# EAGLE design sensorluz_01 (EAGLE 6.1)
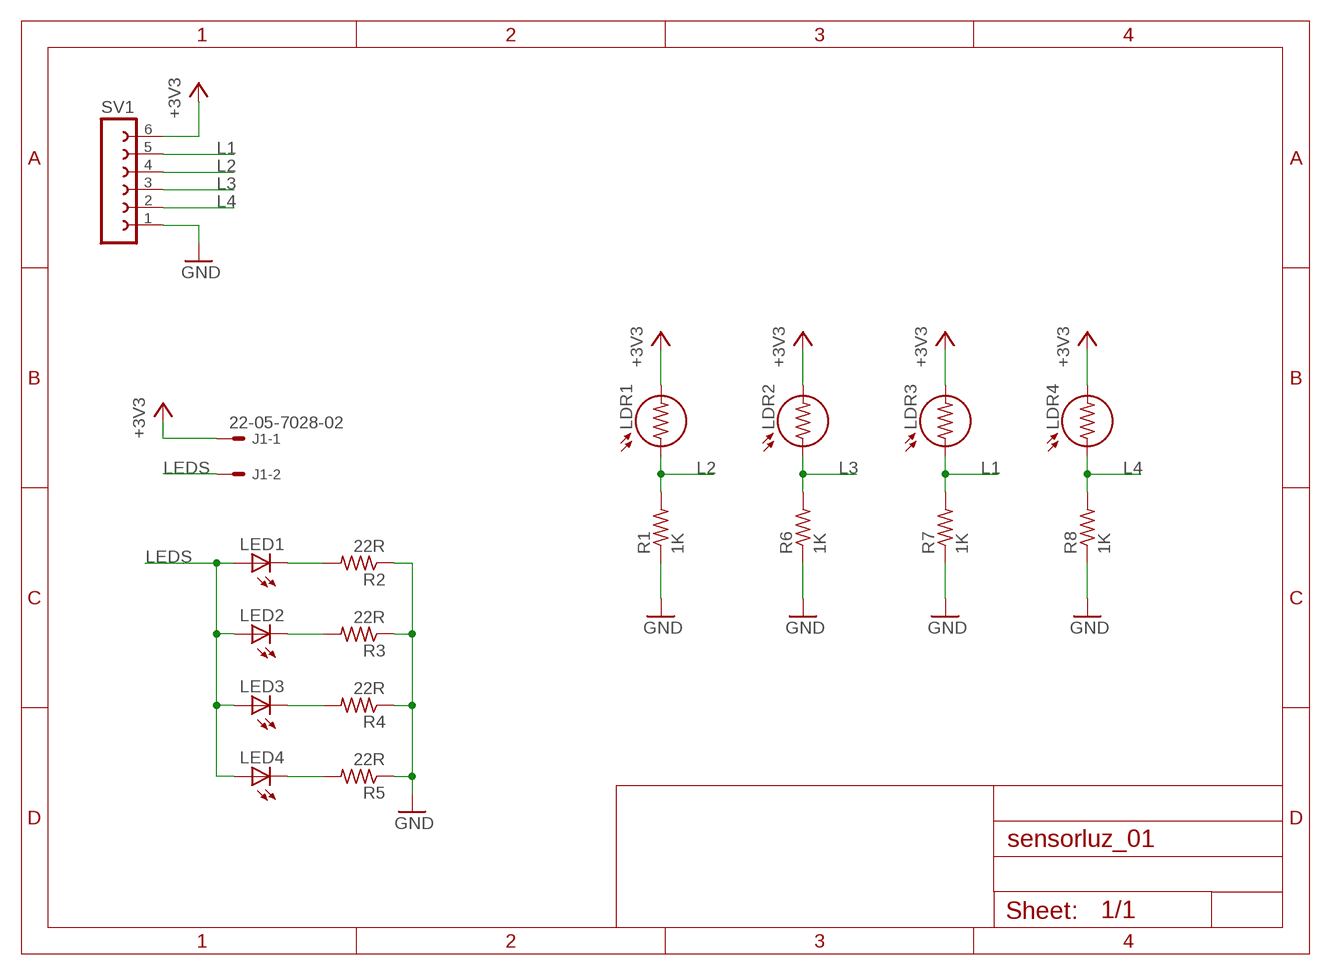
[diagram p0: schematic, sheet 1]

## Parts
J1  22-05-7028-02  [7395-02]
LDR1  LDR5MM  [LDR338-54C]
LDR2  LDR5MM  [LDR338-54C]
LDR3  LDR5MM  [LDR338-54C]
LDR4  LDR5MM  [LDR338-54C]
LED1  LED5MM  [LED5MM]
LED2  LED5MM  [LED5MM]
LED3  LED5MM  [LED5MM]
LED4  LED5MM  [LED5MM]
R1  1K  R-US_0204/5  [0204/5]
R2  22R  R-US_0204/5  [0204/5]
R3  22R  R-US_0204/5  [0204/5]
R4  22R  R-US_0204/5  [0204/5]
R5  22R  R-US_0204/5  [0204/5]
R6  1K  R-US_0204/5  [0204/5]
R7  1K  R-US_0204/5  [0204/5]
R8  1K  R-US_0204/5  [0204/5]
SV1  FE06W  [FE06W]

## Nets
+3V3: J1.1 LDR1.2 LDR2.2 LDR3.2 LDR4.2 SV1.6
GND: R1.1 R2.1 R3.1 R4.1 R5.1 R6.1 R7.1 R8.1 SV1.1
L1: LDR3.1 R7.2 SV1.5
L2: LDR1.1 R1.2 SV1.4
L3: LDR2.1 R6.2 SV1.3
L4: LDR4.1 R8.2 SV1.2
LEDS: J1.2 LED1.A LED2.A LED3.A LED4.A
N$1: LED1.K(C) R2.2
N$2: LED2.K(C) R3.2
N$3: LED3.K(C) R4.2
N$4: LED4.K(C) R5.2

## Library data of the parts
J1 = con-molex:22-?-02: CONNECTOR wire to board 2.54 mm (.1 inch) pitch header
LDR1-LDR4 = gm-resistors:LDR
LED1-LED4 = led:LED: LED OSRAM: - CHIPLED LG R971, LG N971, LY N971, LG Q971, LY Q971, LO R971, LY R971 LH N974, LH R974 LS Q976, LO Q976, LY Q976 LO Q996 - Hyper CHIPLED LW Q18S LB Q993, LB Q99A, LB R99A - SideLED LS A670, LO A670, LY A670, LG A670, LP A670 LB A673, LV A673, LT A673, LW A673 LH A674 LY A675 LS A676, LA A676, LO A676, LY A676, LW A676 LS A679, LY A679, LG A679 - Hyper Micro SIDELED® LS Y876, LA Y876, LO Y876, LY Y876 LT Y87S - SmartLED LW L88C, LW L88S LB L89C, LB L89S, LG L890 LS L89K, LO L89K, LY L89K LS L896, LA L896, LO L896, LY L896 - TOPLED LS T670, LO T670, LY T670, LG T670, LP T670 LSG T670, LSP T670, LSY T670, LOP T670, LYG T670 LG T671, LOG T671, LSG T671 LB T673, LV T673, LT T673, LW T673 LH T674 LS T676, LA T676, LO T676, LY T676, LB T676, LH T676, LSB T676, LW T676 LB T67C, LV T67C, LT T67C, LS T67K, LO T67K, LY T67K, LW E67C LS E67B, LA E67B, LO E67B, LY E67B, LB E67C, LV E67C, LT E67C LW T67C LS T679, LY T679, LG T679 LS T770, LO T770, LY T770, LG T770, LP T770 LB T773, LV T773, LT T773, LW T773 LH T774 LS E675, LA E675, LY E675, LS T675 LS T776, LA T776, LO T776, LY T776, LB T776 LHGB T686 LT T68C, LB T68C - Hyper Mini TOPLED® LB M676 - Mini TOPLED Santana® LG M470 LS M47K, LO M47K, LY M47K Source: http://www.osram.convergy.de LUXEON: - LUMILED® LXK2-PW12-R00, LXK2-PW12-S00, LXK2-PW14-U00, LXK2-PW14-V00 LXK2-PM12-R00, LXK2-PM12-S00, LXK2-PM14-U00 LXK2-PE12-Q00, LXK2-PE12-R00, LXK2-PE12-S00, LXK2-PE14-T00, LXK2-PE14-U00 LXK2-PB12-K00, LXK2-PB12-L00, LXK2-PB12-M00, LXK2-PB14-N00, LXK2-PB14-P00, LXK2-PB14-Q00 LXK2-PR12-L00, LXK2-PR12-M00, LXK2-PR14-Q00, LXK2-PR14-R00 LXK2-PD12-Q00, LXK2-PD12-R00, LXK2-PD12-S00 LXK2-PH12-R00, LXK2-PH12-S00 LXK2-PL12-P00, LXK2-PL12-Q00, LXK2-PL12-R00 Source: www.luxeon.com KINGBRIGHT: KA-3528ASYC Source: www.kingbright.com
R1-R8 = rcl:R-US_: RESISTOR, American symbol
SV1 = con-lsta:FE06W: FEMALE HEADER

## Board
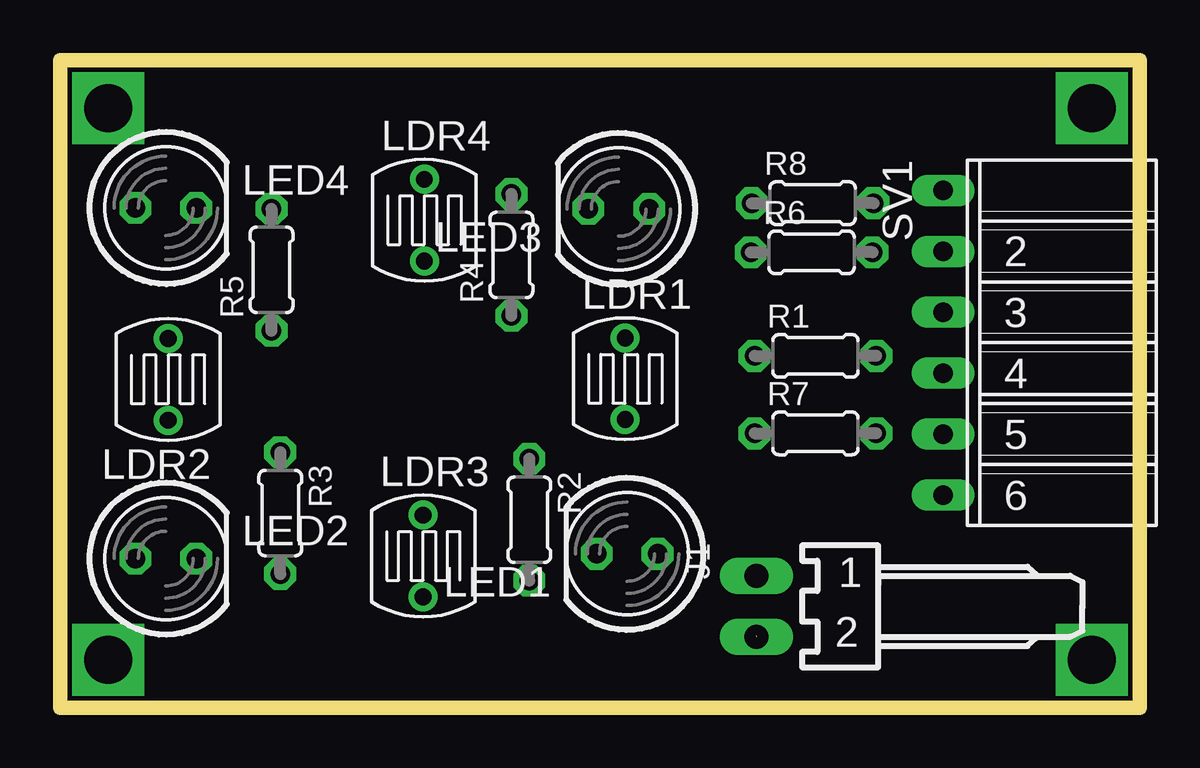
[diagram p1: board, top side]
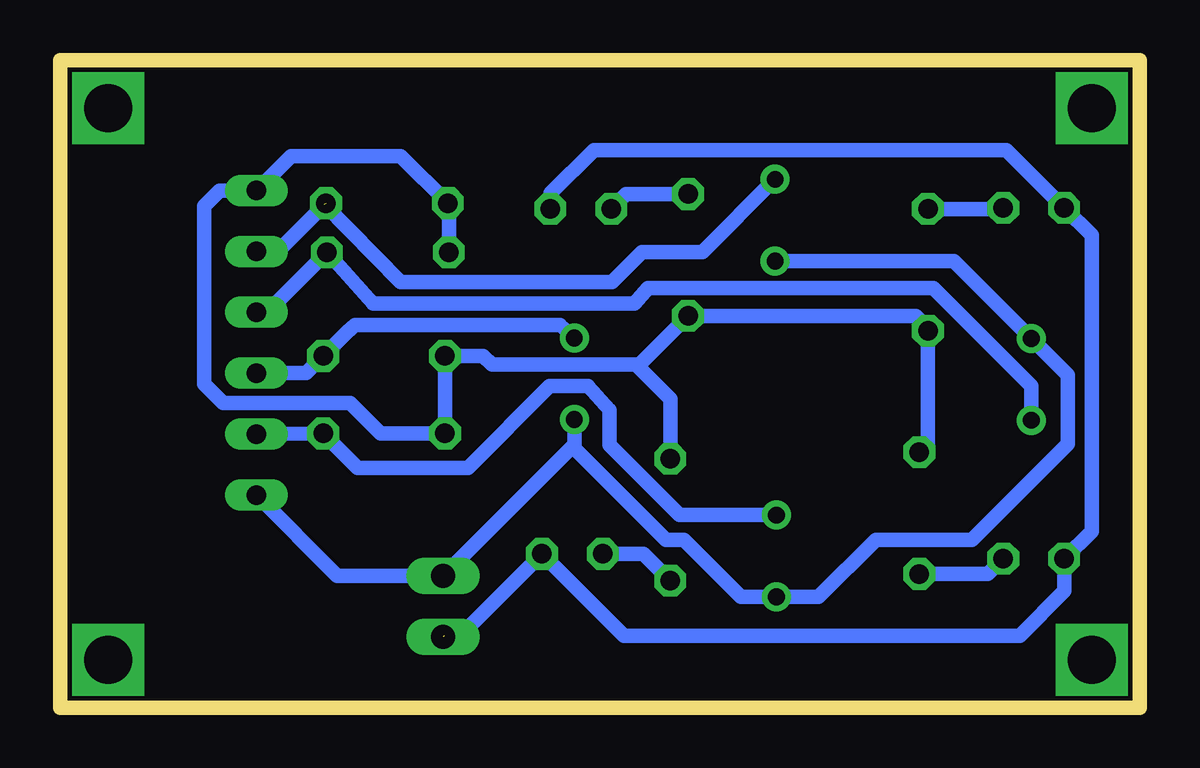
[diagram p2: board, bottom side, seen from below]

Size 45 x 27 mm. Coordinates in mm from the lower left corner, seen from the top.
Outline: 0,0 45,0 45,27 0,27 0,0
Copper layers (1*16): Top 0.035mm / dielectric 1.5mm / Bottom 0.035mm
Design rules: minimum track width 10mil, minimum drill 24mil, track to track 8mil, track to pad 8mil, pad to pad 8mil, via to via 8mil, smd to smd 8mil, copper to edge 40mil, drill to drill 8mil, minimum pad ring 10mil, minimum via ring 8mil, stop-mask expansion 4mil, vias tented up to drill 0mil, thermal gap 10mil

### Footprints (pad centres in the part's own frame; a part is rotated, then mirrored left to right if it is on the bottom)
7395-02 = drill 1.016 long: 1 1.27,0; 2 -1.27,0
LDR338-54C = drill 0.7: 1 0,1.702; 2 0,-1.702
LED5MM = drill 0.813 octagon: A -1.27,0; K 1.27,0
0204/5 = drill 0.813 octagon: 1 -2.54,0; 2 2.54,0
FE06W = drill 0.813 long: 1 -6.35,0; 2 -3.81,0; 3 -1.27,0; 4 1.27,0; 5 3.81,0; 6 6.35,0

### Placement (x,y rotation side)
J1  29.03,4.22 90 top
LDR1  23.56,13.71 0 top
LDR2  4.51,13.68 180 top
LDR3  15.14,6.32 0 top
LDR4  15.19,20.32 0 top
LED1  23.64,6.41 180 top
LED2  4.41,6.21 0 top
LED3  23.29,20.79 180 top
LED4  4.41,20.83 0 top
R1  31.49,14.66 0 top
R2  19.56,7.83 270 top
R3  9.18,8.11 270 top
R4  18.82,18.87 90 top
R5  8.82,18.25 90 top
R6  31.33,18.98 0 top
R7  31.49,11.43 0 top
R8  31.37,21.03 0 top
SV1  36.81,15.21 270 top

### Tracks (layer width: path | path; a pad name or v marks a point on that pad's centre or on a via)
+3V3
  Bottom 0.61: LDR4.2 7.75,18.62 LDR2.2 3,13.87 3,11 7,7 11,7 13.38,4.62 LDR3.2 16.62,4.62 19,7 19.75,7 23.56,10.81 23.56,10.96 | LDR1.2 23.56,10.96 | 23.56,10.96 J1.1 33.44,5.49 SV1.6
GND
  Bottom 0.61: R3.1 8.82,11.01 R5.1 9,15.89 9,16 9.33,16.33 R4.1 20.85,14.3 21,14.3 | 21,14.3 27,14.3 27.36,14.66 R1.1 R7.1 31.64,11.43 32.91,12.7 38.2,12.7 39,13.5 39,20.9 38.34,21.56 SV1.1 35.37,23 30.8,23 R8.1 28.79,20.99 R6.1 | R2.1 19.56,12.86 21,14.3
L1
  Bottom 0.61: LDR3.1 19.17,8.02 22.1,10.95 22.1,12.4 23,13.4 24.6,13.4 28,10 32.6,10 R7.2 36.06,11.4 SV1.5
L2
  Bottom 0.61: SV1.4 34.75,13.94 R1.2 33.04,15.66 32.7,15.95 24.15,15.95 LDR1.1
L3
  Bottom 0.61: LDR2.1 4.51,13.41 8.6,17.5 20.5,17.5 21.05,16.85 31.94,16.85 R6.2 36.37,16.48 SV1.3
L4  (1 unrouted)
  Bottom 0.61: LDR4.1 18.21,19 20.75,19 22,17.75 30.8,17.75 34,21 | SV1.2 35.92,19.02 R8.2
LEDS  (1 unrouted)
  Bottom 0.61: LED3.A 24.56,21.44 22.75,23.25 5.56,23.25 LED4.A 2,19.69 2,7.35 LED2.A 3.14,4.86 5,3 21.5,3 LED1.A 28.32,3 29,3
N$1
  Bottom 0.61: LED1.K 20.68,6.41 R2.2
N$2
  Bottom 0.61: LED2.K 6.32,5.57 R3.2
N$3
  Bottom 0.61: R4.2 21.4,21.41 LED3.K
N$4
  Bottom 0.61: R5.2 5.72,20.79 LED4.K
N$6  (via drill 2)
  other vias: 43,25
N$7  (via drill 2)
  other vias: 43,2
N$8  (via drill 2)
  other vias: 2,25
N$9  (via drill 2)
  other vias: 2,2